# EAGLE design 2022国技館LEDs (EAGLE 9.6.2)
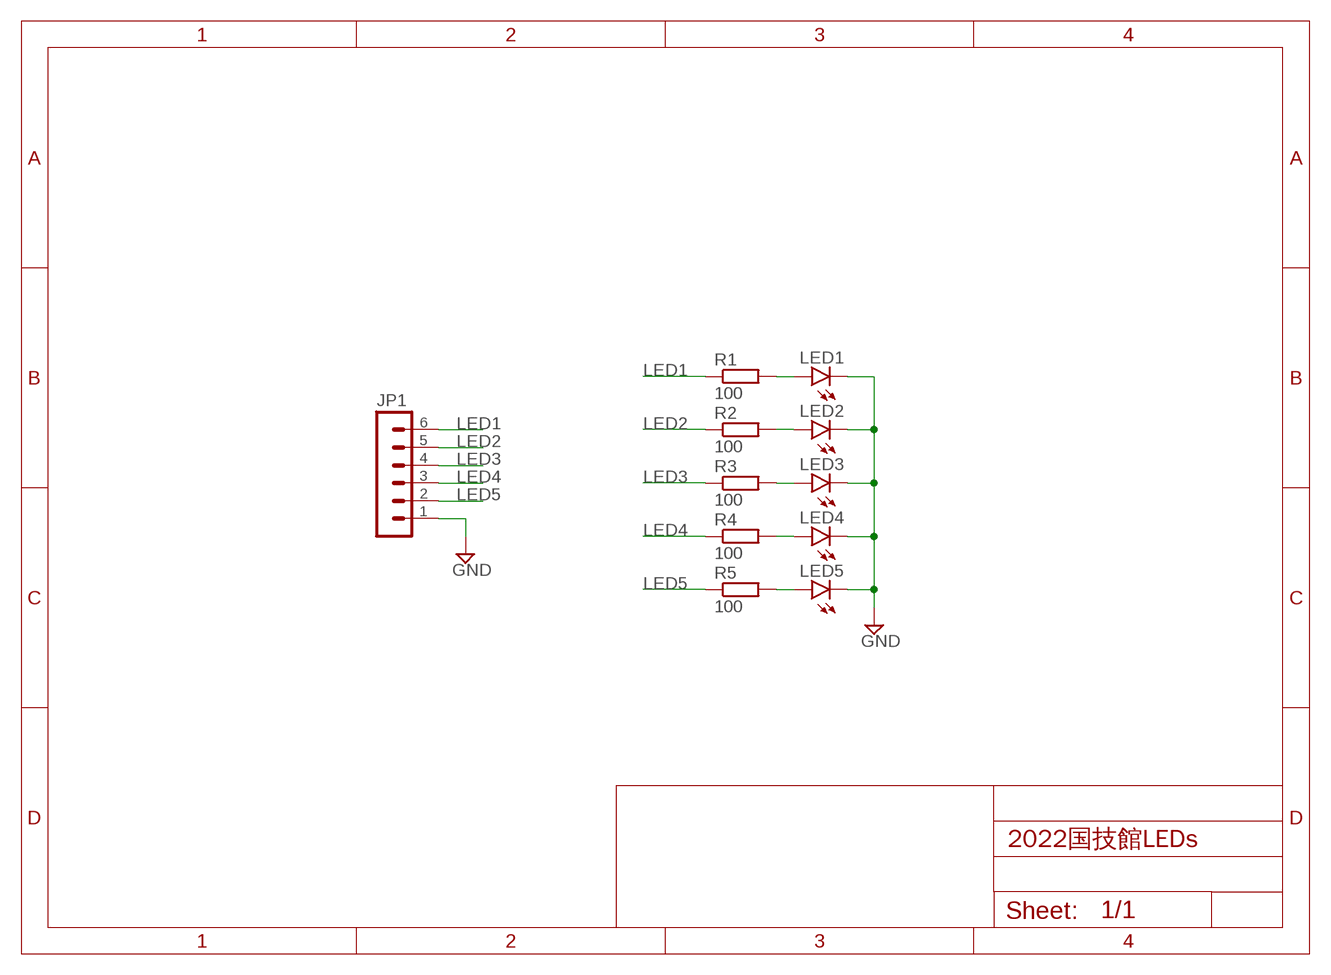
[diagram p0: schematic, sheet 1]

## Parts
JP1  06-JST  [B6B-XH]
LED1  LED5MM  [LED5MM]
LED2  LED5MM  [LED5MM]
LED3  LED5MM  [LED5MM]
LED4  LED5MM  [LED5MM]
LED5  LED5MM  [LED5MM]
R1  100  R-EU_0204/7  [0204/7]
R2  100  R-EU_0204/7  [0204/7]
R3  100  R-EU_0204/7  [0204/7]
R4  100  R-EU_0204/7  [0204/7]
R5  100  R-EU_0204/7  [0204/7]

## Nets
GND: JP1.1 LED1.K(C) LED2.K(C) LED3.K(C) LED4.K(C) LED5.K(C)
LED1: JP1.6 R1.1
LED2: JP1.5 R2.1
LED3: JP1.4 R3.1
LED4: JP1.3 R4.1
LED5: JP1.2 R5.1
N$1: LED1.A R1.2
N$2: LED2.A R2.2
N$3: LED3.A R3.2
N$4: LED4.A R4.2
N$5: LED5.A R5.2

## Library data of the parts
JP1 = con-jst-xh:06-JST: JST CONNECTOR
LED1-LED5 = led:LED: LED OSRAM: - CHIPLED LG R971, LG N971, LY N971, LG Q971, LY Q971, LO R971, LY R971 LH N974, LH R974 LS Q976, LO Q976, LY Q976 LO Q996 - Hyper CHIPLED LW Q18S LB Q993, LB Q99A, LB R99A - SideLED LS A670, LO A670, LY A670, LG A670, LP A670 LB A673, LV A673, LT A673, LW A673 LH A674 LY A675 LS A676, LA A676, LO A676, LY A676, LW A676 LS A679, LY A679, LG A679 - Hyper Micro SIDELED® LS Y876, LA Y876, LO Y876, LY Y876 LT Y87S - SmartLED LW L88C, LW L88S LB L89C, LB L89S, LG L890 LS L89K, LO L89K, LY L89K LS L896, LA L896, LO L896, LY L896 - TOPLED LS T670, LO T670, LY T670, LG T670, LP T670 LSG T670, LSP T670, LSY T670, LOP T670, LYG T670 LG T671, LOG T671, LSG T671 LB T673, LV T673, LT T673, LW T673 LH T674 LS T676, LA T676, LO T676, LY T676, LB T676, LH T676, LSB T676, LW T676 LB T67C, LV T67C, LT T67C, LS T67K, LO T67K, LY T67K, LW E67C LS E67B, LA E67B, LO E67B, LY E67B, LB E67C, LV E67C, LT E67C LW T67C LS T679, LY T679, LG T679 LS T770, LO T770, LY T770, LG T770, LP T770 LB T773, LV T773, LT T773, LW T773 LH T774 LS E675, LA E675, LY E675, LS T675 LS T776, LA T776, LO T776, LY T776, LB T776 LHGB T686 LT T68C, LB T68C - Hyper Mini TOPLED® LB M676 - Mini TOPLED Santana® LG M470 LS M47K, LO M47K, LY M47K Source: http://www.osram.convergy.de LUXEON: - LUMILED® LXK2-PW12-R00, LXK2-PW12-S00, LXK2-PW14-U00, LXK2-PW14-V00 LXK2-PM12-R00, LXK2-PM12-S00, LXK2-PM14-U00 LXK2-PE12-Q00, LXK2-PE12-R00, LXK2-PE12-S00, LXK2-PE14-T00, LXK2-PE14-U00 LXK2-PB12-K00, LXK2-PB12-L00, LXK2-PB12-M00, LXK2-PB14-N00, LXK2-PB14-P00, LXK2-PB14-Q00 LXK2-PR12-L00, LXK2-PR12-M00, LXK2-PR14-Q00, LXK2-PR14-R00 LXK2-PD12-Q00, LXK2-PD12-R00, LXK2-PD12-S00 LXK2-PH12-R00, LXK2-PH12-S00 LXK2-PL12-P00, LXK2-PL12-Q00, LXK2-PL12-R00 Source: www.luxeon.com KINGBRIGHT: KA-3528ASYC Source: www.kingbright.com
R1-R5 = rcl:R-EU_: RESISTOR, European symbol; SPICEPREFIX: R

## Board
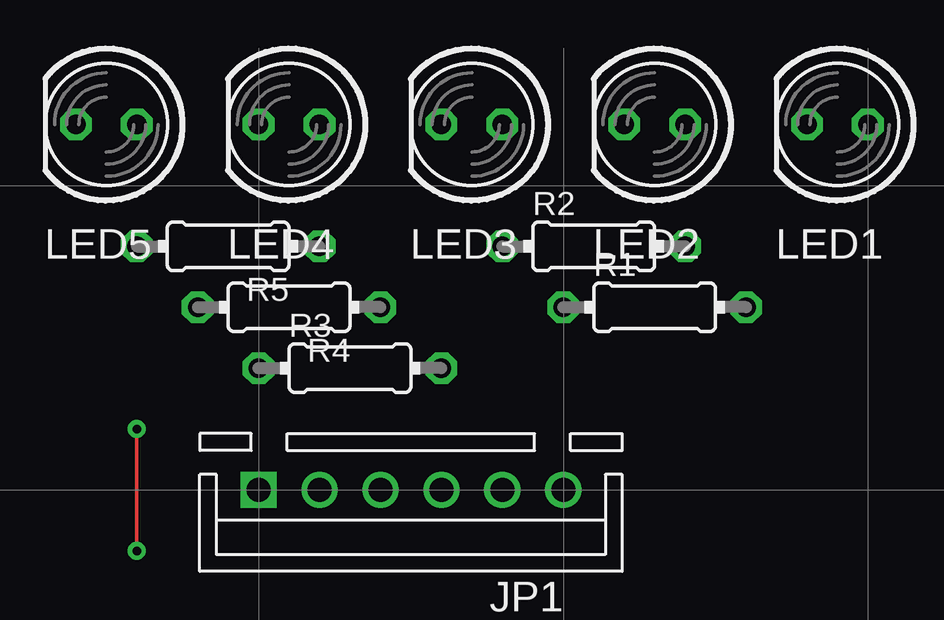
[diagram p1: board, top side]
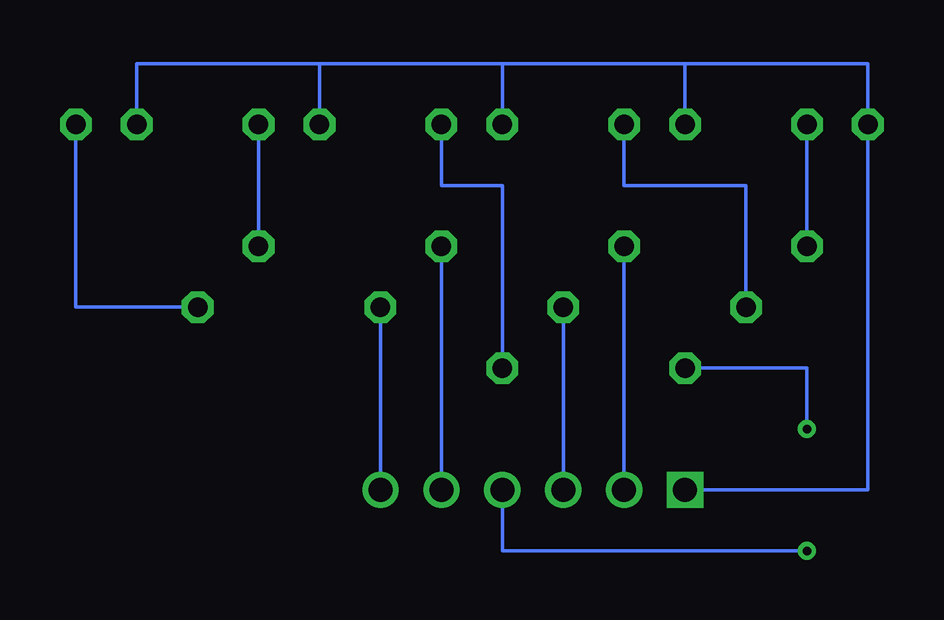
[diagram p2: board, bottom side, seen from below]

No outline drawn. Coordinates in mm, seen from the top.
Copper layers (1*16): Top 0.035mm / dielectric 1.5mm / Bottom 0.035mm
Design rules "default": minimum track width 6mil, minimum drill 0.35mm, track to track 6mil, track to pad 6mil, pad to pad 6mil, via to via 6mil, smd to smd 6mil, copper to edge 40mil, drill to drill 6mil, minimum pad ring 10mil, minimum via ring 8mil, stop-mask expansion 4mil, vias tented up to drill 0mil, thermal gap 10mil
tRestrict: 4 lines

### Footprints (pad centres in the part's own frame; a part is rotated, then mirrored left to right if it is on the bottom)
B6B-XH = drill 1 square: 1 6.35,0 | drill 1: 2 3.81,0; 3 1.27,0; 4 -1.27,0; 5 -3.81,0; 6 -6.35,0
LED5MM = drill 0.813 octagon: A -1.27,0; K 1.27,0
0204/7 = drill 0.813 octagon: 1 -3.81,0; 2 3.81,0

### Placement (x,y rotation side)
JP1  31.75,25.4 180 top
LED1  49.53,40.64 180 top
LED2  41.91,40.64 180 top
LED3  34.29,40.64 180 top
LED4  26.67,40.64 180 top
LED5  19.05,40.64 180 top
R1  41.91,33.02 0 top
R2  39.37,35.56 0 top
R3  29.21,30.48 0 top
R4  26.67,33.02 180 top
R5  24.13,35.56 180 top
U$1  [TYPE.C]  0,0 0 top

### Tracks (layer width: path | path; a pad name or v marks a point on that pad's centre or on a via)
GND
  Bottom 0.152: 25.4,43.18 17.78,43.18 LED5.K 17.78,25.4 JP1.1 | LED4.K 25.4,43.18 | 25.4,43.18 33.02,43.18 | 33.02,43.18 LED3.K | 33.02,43.18 40.64,43.18 | 40.64,43.18 LED2.K | 40.64,43.18 48.26,43.18 LED1.K
LED1
  Bottom 0.152: R1.1 JP1.6
LED2
  Bottom 0.152: R2.1 JP1.5
LED3  (via drill 0.35)
  Top 0.152: v20.32,27.94 v20.32,22.86
  Bottom 0.152: R3.1 20.32,30.48 v20.32,27.94 | v20.32,22.86 33.02,22.86 JP1.4
LED4
  Bottom 0.152: R4.1 JP1.3
LED5
  Bottom 0.152: R5.1 JP1.2
N$1
  Bottom 0.152: R1.2 50.8,33.02 LED1.A
N$2
  Bottom 0.152: R2.2 LED2.A
N$3
  Bottom 0.152: R3.2 33.02,38.1 35.56,38.1 LED3.A
N$4
  Bottom 0.152: R4.2 22.86,38.1 27.94,38.1 LED4.A
N$5
  Bottom 0.152: R5.2 LED5.A